# EAGLE design rgb2hdmi-composite-adapter (EAGLE 9.3.2)
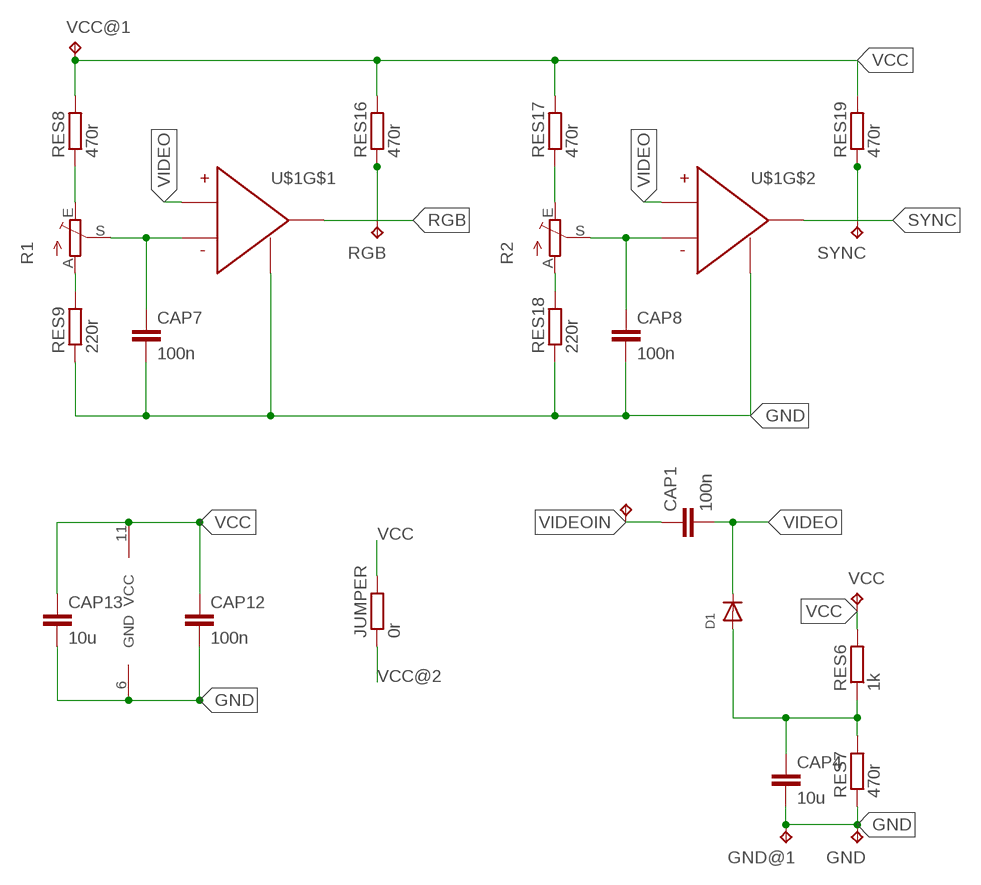
[diagram p0: schematic, sheet 1]

## Parts
CAP1  100n  C-EU025-025X050  [C025-025X050]
CAP4  10u  C-EU025-025X050  [C025-025X050]
CAP7  100n  C-EU025-025X050  [C025-025X050]
CAP8  100n  C-EU025-025X050  [C025-025X050]
CAP12  100n  C-EU025-025X050  [C025-025X050]
CAP13  10u  C-EU025-025X050  [C025-025X050]
D1  DIODEDO-1N4148  [DO-1N4148]
GND  TPPAD1-17Y  [P1-17Y]
GND@1  TPPAD1-17Y  [P1-17Y]
JUMPER  0r  R-EU_0207/10  [0207/10]
R1  TRIM_EU-B64Y  [B64Y]
R2  TRIM_EU-B64Y  [B64Y]
RES6  1k  R-EU_0207/10  [0207/10]
RES7  470r  R-EU_0207/10  [0207/10]
RES8  470r  R-EU_0207/10  [0207/10]
RES9  220r  R-EU_0207/10  [0207/10]
RES16  470r  R-EU_0207/10  [0207/10]
RES17  470r  R-EU_0207/10  [0207/10]
RES18  220r  R-EU_0207/10  [0207/10]
RES19  470r  R-EU_0207/10  [0207/10]
RGB  TPPAD1-17Y  [P1-17Y]
SYNC  TPPAD1-17Y  [P1-17Y]
U$1  LM319PROPER-DIL-14  [DIL14]
VCC  TPPAD1-17Y  [P1-17Y]
VCC@1  TPPAD1-17Y  [P1-17Y]
VIDEOIN  TPPAD1-17Y  [P1-17Y]

## Nets
GND: CAP4.2 CAP7.2 CAP8.2 CAP12.2 CAP13.2 GND.TP GND@1.TP RES7.1 RES9.1 RES18.1 U$1.3(GND) U$1.6(GND) U$1.8(GND)
N$2: CAP4.1 D1.A RES6.1 RES7.2
N$3: R1.A RES9.2
N$4: R2.E RES17.1
N$5: R2.A RES18.2
N$6: R1.E RES8.1
RGB: RES16.1 RGB.TP U$1.12(OUT)
RGBTRIM: CAP7.1 R1.S U$1.5(INV)
SYNC: RES19.1 SYNC.TP U$1.7(OUT)
SYNCTRIM: CAP8.1 R2.S U$1.10(INV)
VCC: CAP12.1 CAP13.1 JUMPER.2 RES6.2 RES8.2 RES16.2 RES17.2 RES19.2 U$1.11(VCC) VCC.TP VCC@1.TP
VCC@2: JUMPER.1
VIDEO: CAP1.2 D1.C U$1.4(NONINV) U$1.9(NONINV)
VIDEOIN: CAP1.1 VIDEOIN.TP

## Library data of the parts
CAP1 CAP4 CAP7 CAP8 CAP12 CAP13 = rcl:C-EU: CAPACITOR, European symbol; SPICEPREFIX: C
D1 = adafruit:DIODE: Diode SMADIODE - SMA Surface Mount Package 20V 1A Schottky Diode Digikey: 641-1014-6-ND DO-1N4148 - Through Hole Small Current Diode SOD-123 20V 1 A (.5mV Vf) Schottky Diode - Digikey: MBRX120TPMSCT-ND SOD-323 10V 570mA (.38mV Vf, 3ns) Schottky Diode - Digikey: ZLLS410CT-ND SOD-523 30V 30mA Schottky Diode (RB751S-40TE61) - Digikey: RB751S-40TE61CT-ND SOT23-R/W - SOT23 Package (R = Solder Paste/Reflow Ovens, W = Hand-Soldering) BAT54Film 40V 300mA - Digikey: 497-7162-1-ND
GND GND@1 RGB SYNC VCC VCC@1 VIDEOIN = testpad:TP: Test pad
JUMPER RES6-RES9 RES16-RES19 = rcl:R-EU_: RESISTOR, European symbol; SPICEPREFIX: R
R1 R2 = pot:TRIM_EU-: POTENTIOMETER
U$1 = LM319:LM319

## Board
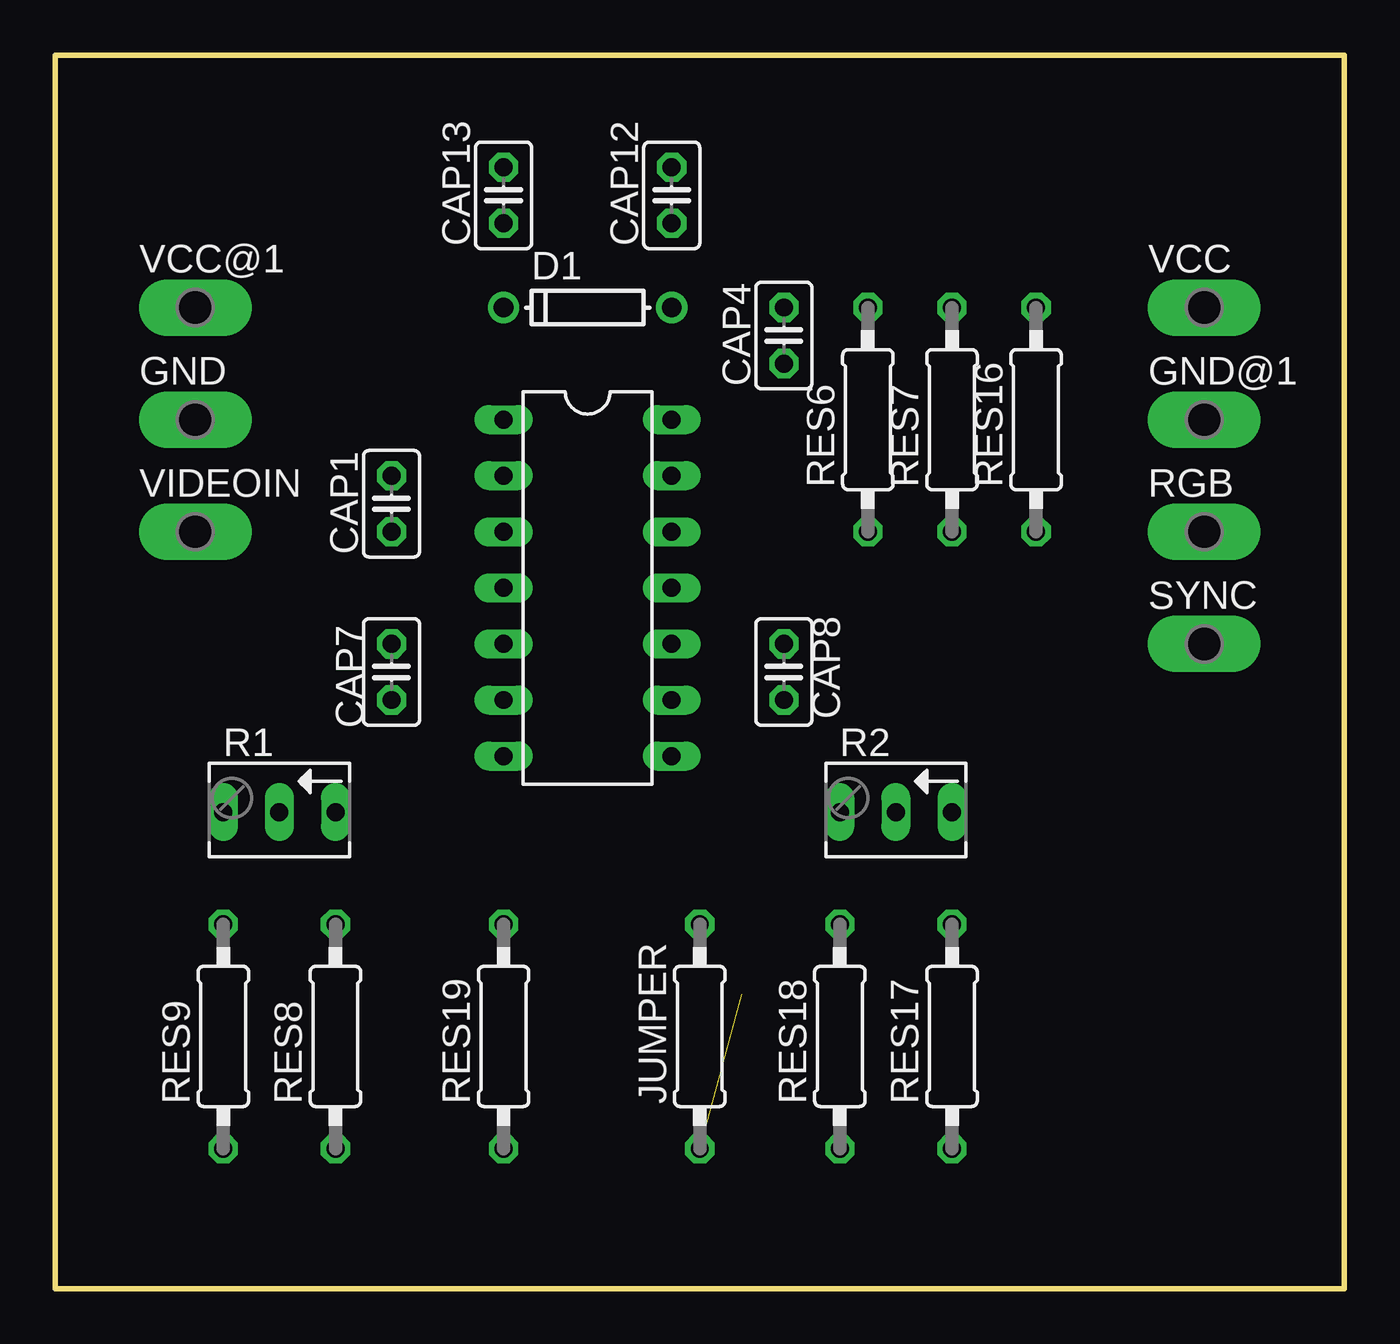
[diagram p1: board, top side]
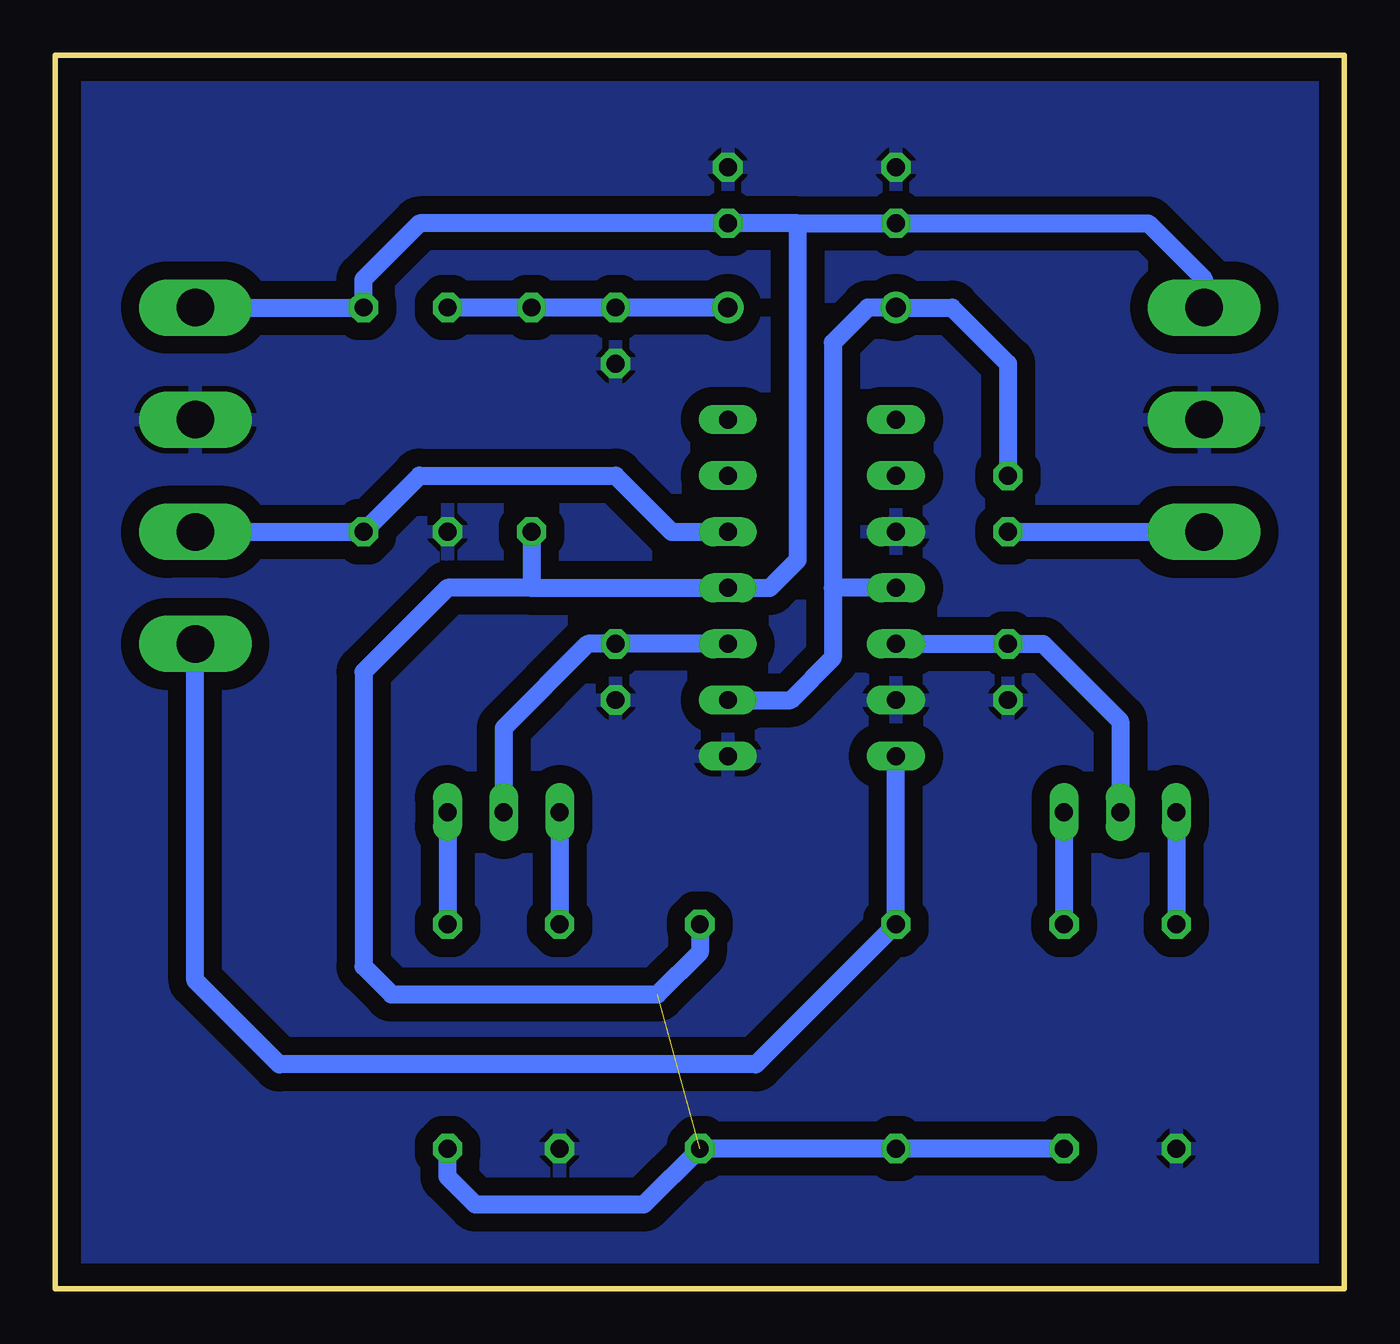
[diagram p2: board, bottom side, seen from below]

Size 58.42 x 55.88 mm. Coordinates in mm from the lower left corner, seen from the top.
Outline: 0,0 58.42,0 58.42,55.88 0,55.87 0,0
Copper layers (1*16): Top 0.035mm / dielectric 1.5mm / Bottom 0.035mm
Design rules "default *": minimum track width 6mil, minimum drill 0.35mm, track to track 6mil, track to pad 6mil, pad to pad 6mil, via to via 6mil, smd to smd 6mil, copper to edge 40mil, drill to drill 6mil, minimum pad ring 10mil, minimum via ring 8mil, stop-mask expansion 4mil, vias tented up to drill 0mil, thermal gap 10mil

### Footprints (pad centres in the part's own frame; a part is rotated, then mirrored left to right if it is on the bottom)
C025-025X050 = drill 0.813 octagon: 1 -1.27,0; 2 1.27,0
DO-1N4148 = drill 0.9: A -3.81,0; C 3.81,0
P1-17Y = drill 1.702 pad 2.121 long: TP 0,0
0207/10 = drill 0.813 octagon: 1 -5.08,0; 2 5.08,0
B64Y = drill 0.813 long: A 2.54,0; E -2.54,0; S 0,0
DIL14 = drill 0.813 long: 1 -7.62,-3.81; 2 -5.08,-3.81; 3 -2.54,-3.81; 4 0,-3.81; 5 2.54,-3.81; 6 5.08,-3.81; 7 7.62,-3.81; 8 7.62,3.81; 9 5.08,3.81; 10 2.54,3.81; 11 0,3.81; 12 -2.54,3.81; 13 -5.08,3.81; 14 -7.62,3.81

### Placement (x,y rotation side)
CAP1  15.24,35.56 90 top
CAP4  33.02,43.18 270 top
CAP7  15.24,27.94 270 top
CAP8  33.02,27.94 270 top
CAP12  27.94,49.53 90 top
CAP13  20.32,49.53 90 top
D1  24.13,44.45 180 top
GND  6.35,39.37 90 top
GND@1  52.07,39.37 90 top
JUMPER  29.21,11.43 270 top
R1  10.16,21.59 180 top
R2  38.1,21.59 180 top
RES6  36.83,39.37 270 top
RES7  40.64,39.37 90 top
RES8  12.7,11.43 270 top
RES9  7.62,11.43 90 top
RES16  44.45,39.37 90 top
RES17  40.64,11.43 270 top
RES18  35.56,11.43 90 top
RES19  20.32,11.43 270 top
RGB  52.07,34.29 270 top
SYNC  52.07,29.21 90 top
U$1  24.13,31.75 270 top
VCC  52.07,44.45 270 top
VCC@1  6.35,44.45 90 top
VIDEOIN  6.35,34.29 90 top

### Tracks (layer width: path | path; a pad name or v marks a point on that pad's centre or on a via)
GND
  pour Bottom (isolate 0.813): 1.27,54.61 57.15,54.61 57.15,1.27 1.27,1.27
N$2
  Bottom 0.813: D1.A CAP4.1 RES6.1 RES7.2
N$3
  Bottom 0.813: R1.A RES9.2
N$4
  Bottom 0.813: R2.E RES17.1
N$5
  Bottom 0.813: R2.A RES18.2
N$6
  Bottom 0.813: R1.E RES8.1
RGB
  Bottom 0.813: RGB.TP RES16.1 41.91,36.83 33.02,36.83 30.48,34.29 U$1.12
RGBTRIM
  Bottom 0.813: R1.S 10.16,25.72 13.65,29.21 CAP7.1 U$1.5
SYNC
  Bottom 0.813: SYNC.TP 52.07,13.97 48.26,10.16 26.67,10.16 RES19.1 U$1.7
SYNCTRIM
  Bottom 0.813: R2.S 38.1,25.4 34.29,29.21 CAP8.1 U$1.10
VCC  (1 unrouted)
  Bottom 0.813: 24.77,48.26 24.77,33.02 26.04,31.75 U$1.11 36.83,31.75 | RES6.2 36.83,31.75 | 24.77,48.26 CAP13.1 8.89,48.26 6.35,45.72 VCC@1.TP | 24.77,48.26 CAP12.1 41.91,48.26 44.45,45.72 RES16.2 VCC.TP | 36.83,31.75 40.64,31.75 44.45,27.94 44.45,14.61 43.18,13.34 31.11,13.34 | RES8.2 RES19.2 JUMPER.2 31.75,3.81 39.37,3.81 40.64,5.08 RES17.2
VCC@2
  Bottom 0.813: JUMPER.1 29.21,15.24 31.11,13.34
VIDEO
  Bottom 0.813: CAP1.2 15.24,41.91 17.78,44.45 D1.C 21.59,44.45 23.18,42.86 23.18,31.75 | 23.18,31.75 23.18,28.57 25.08,26.67 U$1.9 | U$1.4 23.18,31.75
VIDEOIN
  Bottom 0.813: CAP1.1 VIDEOIN.TP